# EAGLE design V2_aktuell_StdTeile_panel (EAGLE 6.5.0)

## Sheet 1 of 4
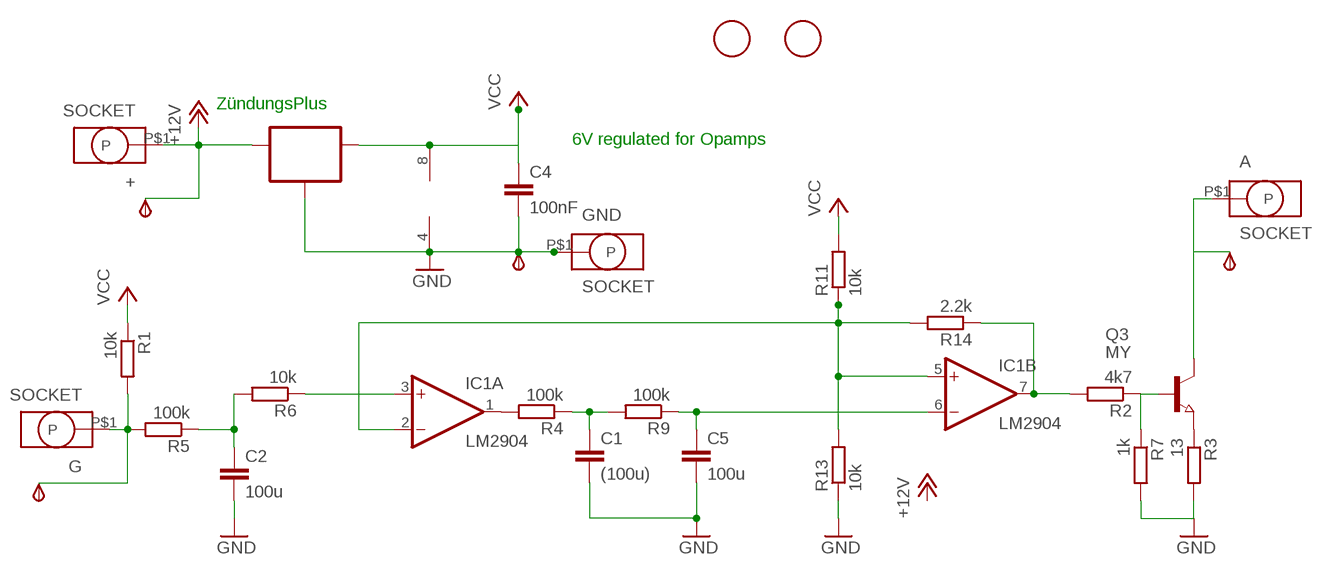
[diagram p0: schematic, sheet 1]

### Parts
+  SOCKET  [ID2.5MM]
A  SOCKET  [ID2.5MM]
C1  (100u)  C-EUC1206K  [C1206K]
C2  100u  C-EUC1206K  [C1206K]
C4  100nF  C-EUC0805  [C0805]
C5  100u  C-EUC1206K  [C1206K]
G  SOCKET  [ID2.5MM]
GND  SOCKET  [ID2.5MM]
GND_  TPSB2.0  [B2.0]
IC1  LM2904  LM358D  [SO08]
IC2  70L06  78LXXSOT89_ROUND  [SOT89_ROUND]
IN  TPSB2.0  [B2.0]
OUT  TPSB2.0  [B2.0]
Q3  MY  NPN-TRANSISTOR_SOT89  [SOT89]
R1  10k  R-EU_R0805  [R0805]
R2  4k7  R-EU_R0805  [R0805]
R3  13  R-EU_R1206  [R1206]
R4  100k  R-EU_R0805  [R0805]
R5  100k  R-EU_R0805  [R0805]
R6  10k  R-EU_R0805  [R0805]
R7  1k  R-EU_R0805  [R0805]
R9  100k  R-EU_R0805  [R0805]
R11  10k  R-EU_R0805  [R0805]
R13  10k  R-EU_R0805  [R0805]
R14  2.2k  R-EU_R0805  [R0805]
U$1  FIDUCIALFIDUCIAL_1MM_WITH_SOLDERMASK  [FIDUCIAL_1MM_WITH_SOLDERMASK]
U$2  FIDUCIALFIDUCIAL_1MM_WITH_SOLDERMASK  [FIDUCIAL_1MM_WITH_SOLDERMASK]
V+  TPSB2.0  [B2.0]

### Nets
+12V: +.P$1(P) IC2.3(IN) V+.TP(PP) ; also sheet 2,3,4
GND: C1.2 C2.2 C4.2 C5.2 GND.P$1(P) GND_.TP(PP) IC1.4(P:V-) IC2.2(GND) IC2.2@1(GND) R3.2 R7.2 R13.1 ; also sheet 2,3,4
N$1: C2.1 R5.1 R6.2
N$2: Q3.1(B) R2.1 R7.1
N$3: C1.1 R4.1 R9.2
N$4: C5.1 IC1.6(B:-IN) R9.1
N$5: IC1.2(A:-IN) IC1.5(B:+IN) R11.1 R13.2 R14.2
N$6: G.P$1(P) IN.TP(PP) R1.2 R5.2
N$7: Q3.3(E) R3.1
N$9: IC1.3(A:+IN) R6.1
N$10: IC1.7(B:OUT) R2.2 R14.1
N$11: A.P$1(P) OUT.TP(PP) Q3.2(C)
N$580: IC1.1(A:OUT) R4.2
VCC: C4.1 IC1.8(P:V+) IC2.1(OUT) R1.1 R11.2 ; also sheet 2,3,4

### Notes on the sheet
- ZündungsPlus
- 6V regulated for Opamps

## Sheet 2 of 4
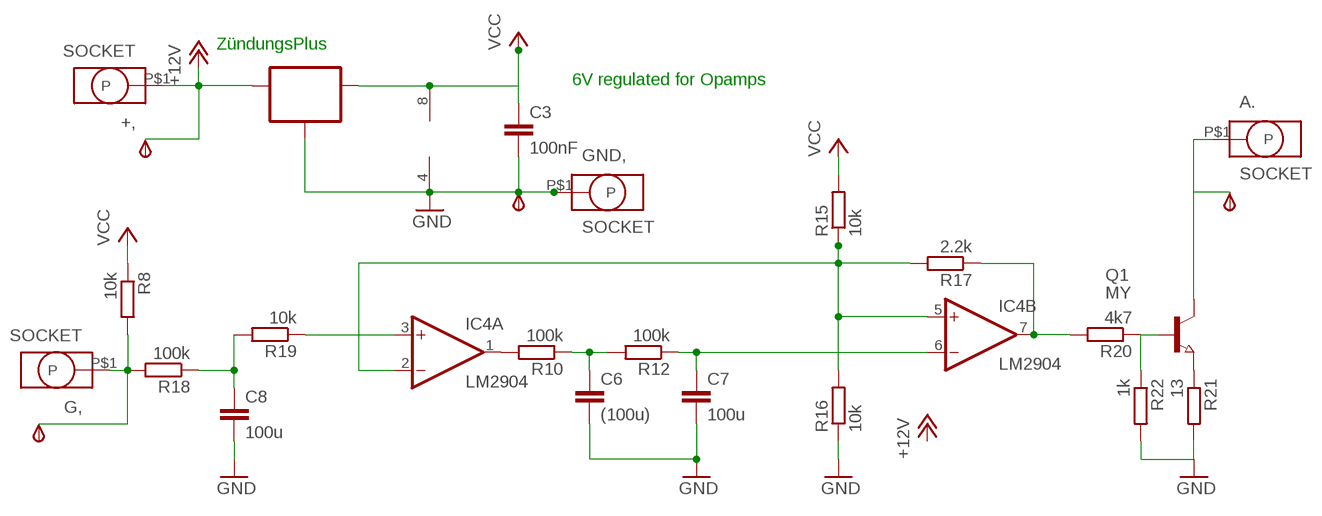
[diagram p1: schematic, sheet 2]

### Parts
+,  SOCKET  [ID2.5MM]
A.  SOCKET  [ID2.5MM]
C3  100nF  C-EUC0805  [C0805]
C6  (100u)  C-EUC1206K  [C1206K]
C7  100u  C-EUC1206K  [C1206K]
C8  100u  C-EUC1206K  [C1206K]
G,  SOCKET  [ID2.5MM]
GND,  SOCKET  [ID2.5MM]
GND_1  TPSB2.0  [B2.0]
IC3  70L06  78LXXSOT89_ROUND  [SOT89_ROUND]
IC4  LM2904  LM358D  [SO08]
IN,  TPSB2.0  [B2.0]
OUT.  TPSB2.0  [B2.0]
Q1  MY  NPN-TRANSISTOR_SOT89  [SOT89]
R8  10k  R-EU_R0805  [R0805]
R10  100k  R-EU_R0805  [R0805]
R12  100k  R-EU_R0805  [R0805]
R15  10k  R-EU_R0805  [R0805]
R16  10k  R-EU_R0805  [R0805]
R17  2.2k  R-EU_R0805  [R0805]
R18  100k  R-EU_R0805  [R0805]
R19  10k  R-EU_R0805  [R0805]
R20  4k7  R-EU_R0805  [R0805]
R21  13  R-EU_R1206  [R1206]
R22  1k  R-EU_R0805  [R0805]
V+,  TPSB2.0  [B2.0]

### Nets
+12V: +,.P$1(P) IC3.3(IN) V+,.TP(PP) ; also sheet 1,3,4
GND: C3.2 C6.2 C7.2 C8.2 GND,.P$1(P) GND_1.TP(PP) IC3.2(GND) IC3.2@1(GND) IC4.4(P:V-) R16.1 R21.2 R22.2 ; also sheet 1,3,4
N$20: IC4.1(A:OUT) R10.2
N$21: C6.1 R10.1 R12.2
N$22: C7.1 IC4.6(B:-IN) R12.1
N$23: IC4.2(A:-IN) IC4.5(B:+IN) R15.1 R16.2 R17.2
N$24: IC4.7(B:OUT) R17.1 R20.2
N$25: C8.1 R18.1 R19.2
N$26: G,.P$1(P) IN,.TP(PP) R8.2 R18.2
N$27: IC4.3(A:+IN) R19.1
N$28: Q1.1(B) R20.1 R22.1
N$29: A..P$1(P) OUT..TP(PP) Q1.2(C)
N$30: Q1.3(E) R21.1
VCC: C3.1 IC3.1(OUT) IC4.8(P:V+) R8.1 R15.2 ; also sheet 1,3,4

### Notes on the sheet
- ZündungsPlus
- 6V regulated for Opamps

## Sheet 3 of 4
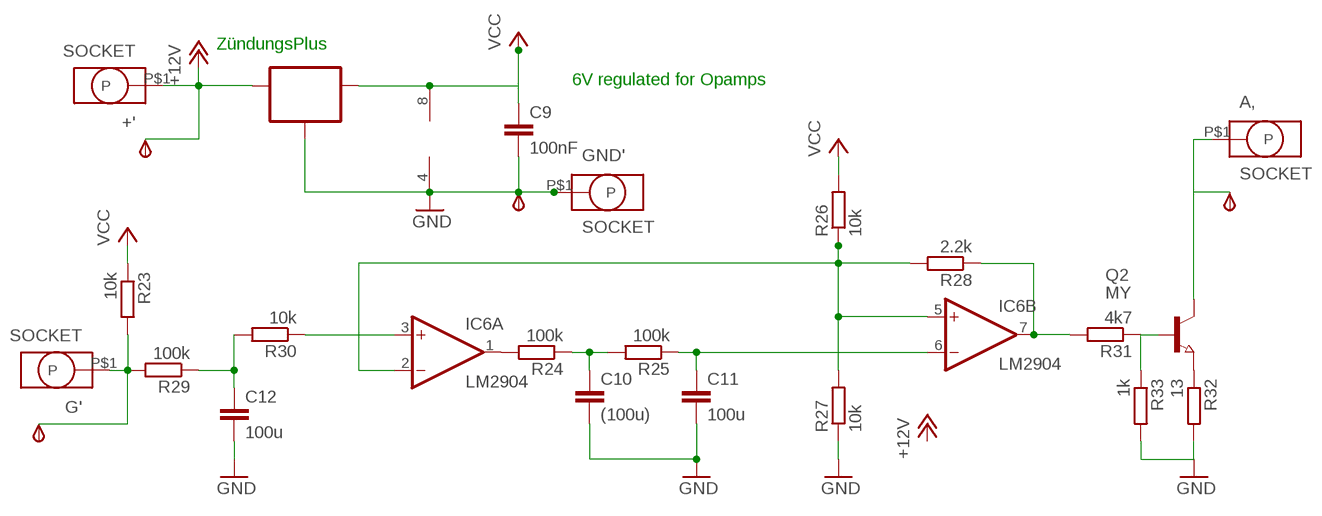
[diagram p2: schematic, sheet 3]

### Parts
+'  SOCKET  [ID2.5MM]
A,  SOCKET  [ID2.5MM]
C9  100nF  C-EUC0805  [C0805]
C10  (100u)  C-EUC1206K  [C1206K]
C11  100u  C-EUC1206K  [C1206K]
C12  100u  C-EUC1206K  [C1206K]
G'  SOCKET  [ID2.5MM]
GND'  SOCKET  [ID2.5MM]
GND_2  TPSB2.0  [B2.0]
IC5  70L06  78LXXSOT89_ROUND  [SOT89_ROUND]
IC6  LM2904  LM358D  [SO08]
IN.  TPSB2.0  [B2.0]
OUT'  TPSB2.0  [B2.0]
Q2  MY  NPN-TRANSISTOR_SOT89  [SOT89]
R23  10k  R-EU_R0805  [R0805]
R24  100k  R-EU_R0805  [R0805]
R25  100k  R-EU_R0805  [R0805]
R26  10k  R-EU_R0805  [R0805]
R27  10k  R-EU_R0805  [R0805]
R28  2.2k  R-EU_R0805  [R0805]
R29  100k  R-EU_R0805  [R0805]
R30  10k  R-EU_R0805  [R0805]
R31  4k7  R-EU_R0805  [R0805]
R32  13  R-EU_R1206  [R1206]
R33  1k  R-EU_R0805  [R0805]
V+.  TPSB2.0  [B2.0]

### Nets
+12V: +'.P$1(P) IC5.3(IN) V+..TP(PP) ; also sheet 1,2,4
GND: C9.2 C10.2 C11.2 C12.2 GND'.P$1(P) GND_2.TP(PP) IC5.2(GND) IC5.2@1(GND) IC6.4(P:V-) R27.1 R32.2 R33.2 ; also sheet 1,2,4
N$40: IC6.1(A:OUT) R24.2
N$41: C10.1 R24.1 R25.2
N$42: C11.1 IC6.6(B:-IN) R25.1
N$43: IC6.2(A:-IN) IC6.5(B:+IN) R26.1 R27.2 R28.2
N$44: IC6.7(B:OUT) R28.1 R31.2
N$45: C12.1 R29.1 R30.2
N$46: G'.P$1(P) IN..TP(PP) R23.2 R29.2
N$47: IC6.3(A:+IN) R30.1
N$48: Q2.1(B) R31.1 R33.1
N$49: A,.P$1(P) OUT'.TP(PP) Q2.2(C)
N$50: Q2.3(E) R32.1
VCC: C9.1 IC5.1(OUT) IC6.8(P:V+) R23.1 R26.2 ; also sheet 1,2,4

### Notes on the sheet
- ZündungsPlus
- 6V regulated for Opamps

## Sheet 4 of 4
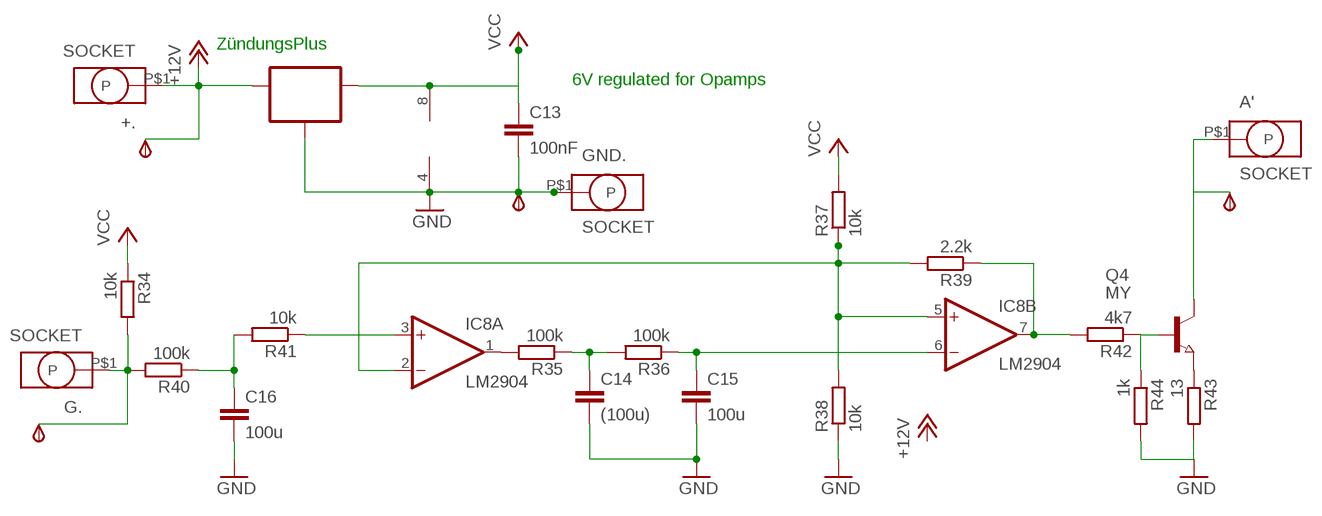
[diagram p3: schematic, sheet 4]

### Parts
+.  SOCKET  [ID2.5MM]
A'  SOCKET  [ID2.5MM]
C13  100nF  C-EUC0805  [C0805]
C14  (100u)  C-EUC1206K  [C1206K]
C15  100u  C-EUC1206K  [C1206K]
C16  100u  C-EUC1206K  [C1206K]
G.  SOCKET  [ID2.5MM]
GND.  SOCKET  [ID2.5MM]
GND_3  TPSB2.0  [B2.0]
IC7  70L06  78LXXSOT89_ROUND  [SOT89_ROUND]
IC8  LM2904  LM358D  [SO08]
IN'  TPSB2.0  [B2.0]
OUT,  TPSB2.0  [B2.0]
Q4  MY  NPN-TRANSISTOR_SOT89  [SOT89]
R34  10k  R-EU_R0805  [R0805]
R35  100k  R-EU_R0805  [R0805]
R36  100k  R-EU_R0805  [R0805]
R37  10k  R-EU_R0805  [R0805]
R38  10k  R-EU_R0805  [R0805]
R39  2.2k  R-EU_R0805  [R0805]
R40  100k  R-EU_R0805  [R0805]
R41  10k  R-EU_R0805  [R0805]
R42  4k7  R-EU_R0805  [R0805]
R43  13  R-EU_R1206  [R1206]
R44  1k  R-EU_R0805  [R0805]
V+'  TPSB2.0  [B2.0]

### Nets
+12V: +..P$1(P) IC7.3(IN) V+'.TP(PP) ; also sheet 1,2,3
GND: C13.2 C14.2 C15.2 C16.2 GND..P$1(P) GND_3.TP(PP) IC7.2(GND) IC7.2@1(GND) IC8.4(P:V-) R38.1 R43.2 R44.2 ; also sheet 1,2,3
N$51: IC8.1(A:OUT) R35.2
N$52: C14.1 R35.1 R36.2
N$53: C15.1 IC8.6(B:-IN) R36.1
N$54: IC8.2(A:-IN) IC8.5(B:+IN) R37.1 R38.2 R39.2
N$55: IC8.7(B:OUT) R39.1 R42.2
N$56: C16.1 R40.1 R41.2
N$57: G..P$1(P) IN'.TP(PP) R34.2 R40.2
N$58: IC8.3(A:+IN) R41.1
N$59: Q4.1(B) R42.1 R44.1
N$60: A'.P$1(P) OUT,.TP(PP) Q4.2(C)
N$61: Q4.3(E) R43.1
VCC: C13.1 IC7.1(OUT) IC8.8(P:V+) R34.1 R37.2 ; also sheet 1,2,3

### Notes on the sheet
- ZündungsPlus
- 6V regulated for Opamps

## Library data of the parts
+ +' +, +. A A' A, A. G G' G, G. GND GND' GND, GND. = Brotbox_Socket_Header:SOCKET
C1-C16 = rcl:C-EU: CAPACITOR, European symbol
GND_ GND_1-GND_3 IN IN' IN, IN. OUT OUT' OUT, OUT. V+ V+' V+, V+. = testpin_BMW:TPS: TEST PIN
IC1 IC4 IC6 IC8 = linear_BMW:LM358: OP AMP also LM158; LM258; LM2904 Source: http://cache.national.com/ds/LM/LM158.pdf
IC2 IC3 IC5 IC7 = 78LXX:78LXX
Q1-Q4 = Transistor_SOT89:NPN-TRANSISTOR_: NPN TRANSISTOR
R1-R44 = rcl:R-EU_: RESISTOR, European symbol
U$1 U$2 = Fiducial:FIDUCIAL: For use by pick and place machines to calibrate the vision/machine, 1mm By microbuilder.eu

## Board
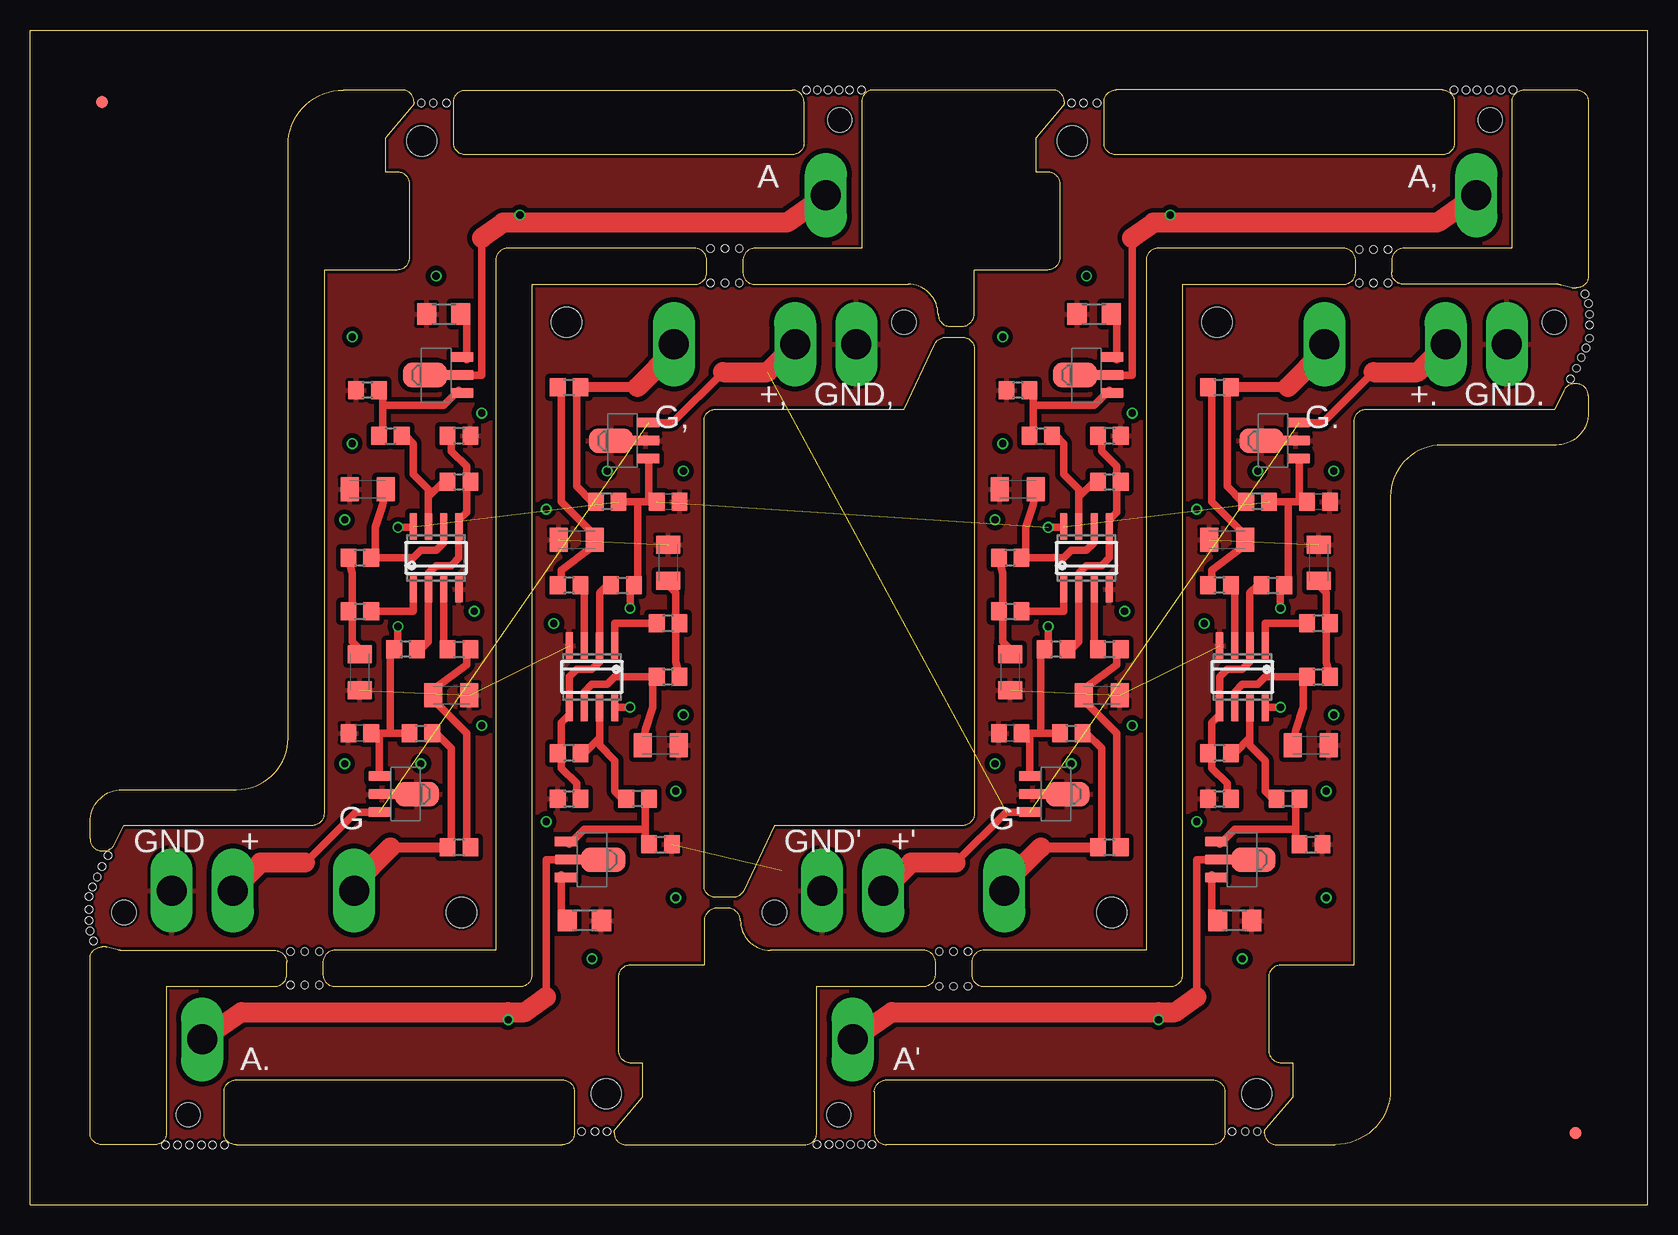
[diagram p4: board, top side]
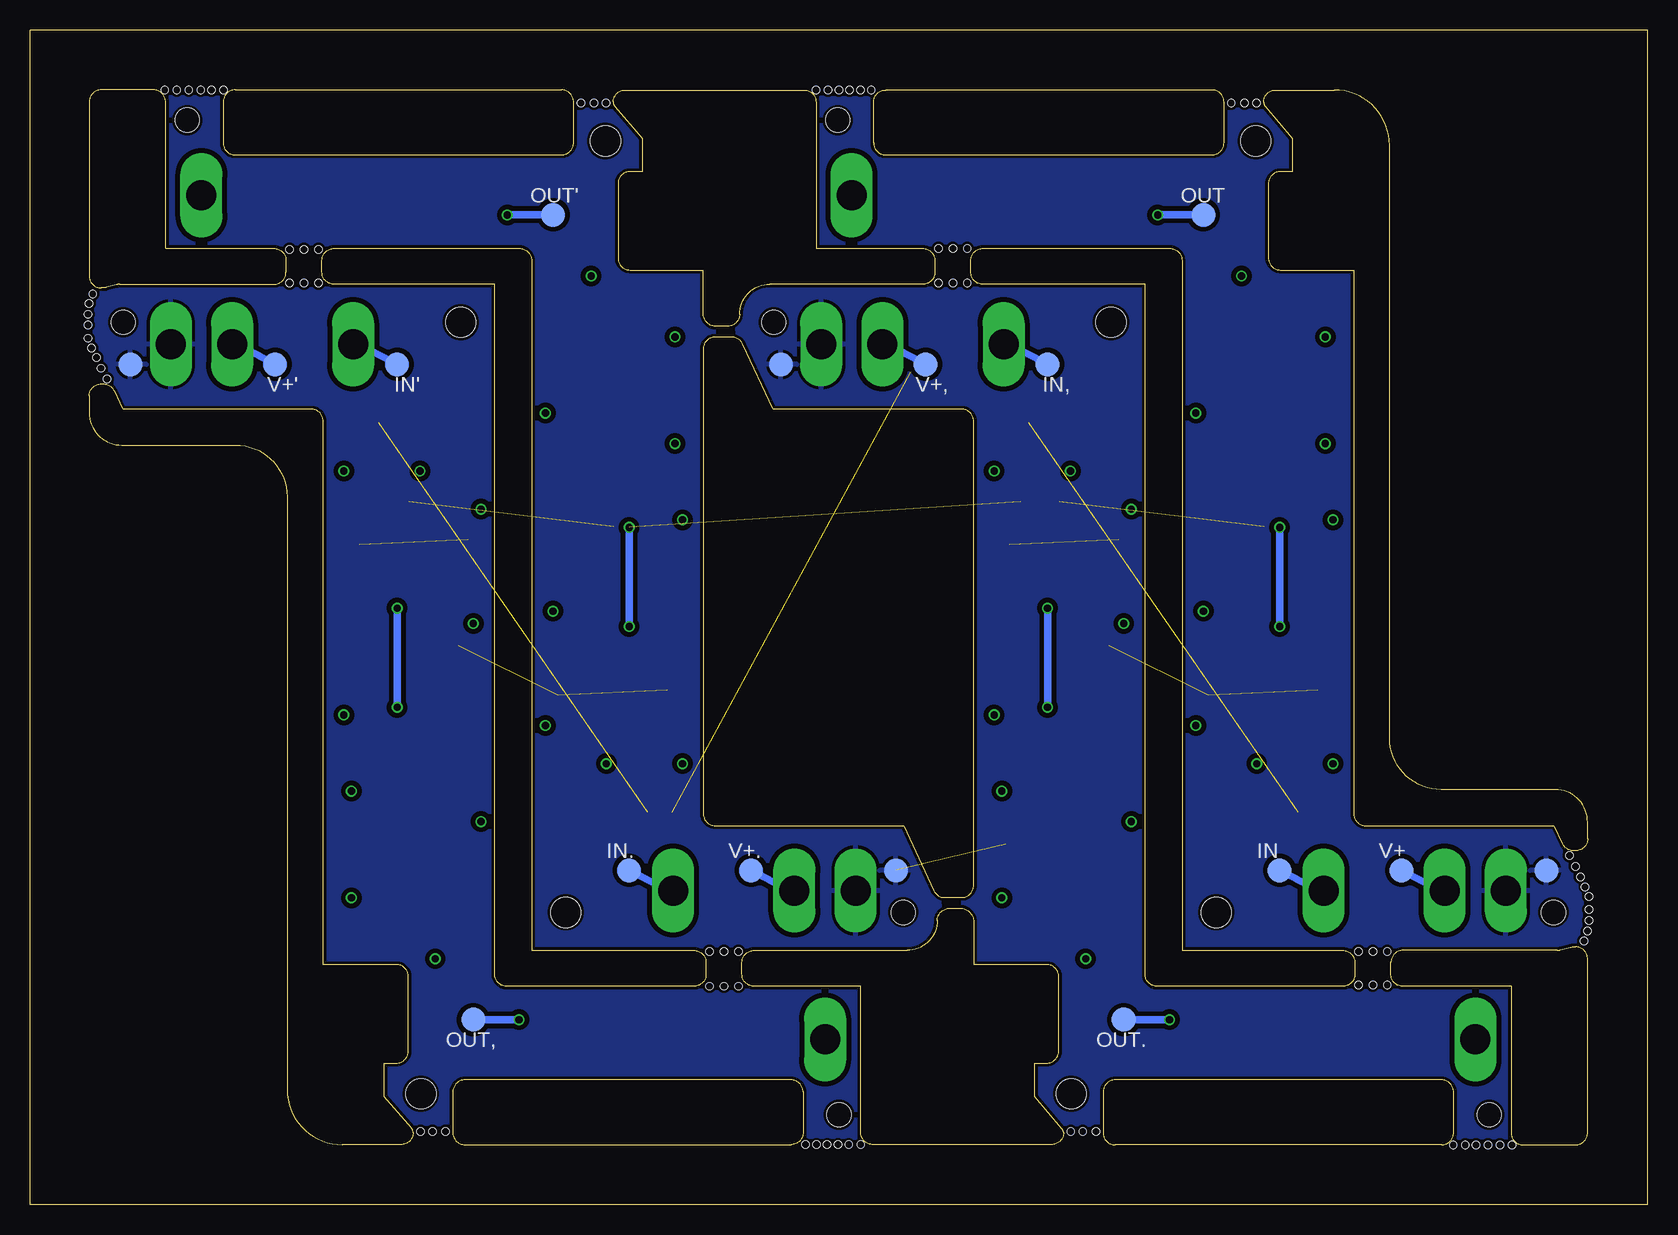
[diagram p5: board, bottom side, seen from below]

Size 134.8 x 97.9 mm. Coordinates in mm from the lower left corner, seen from the top.
Outline: 45.37,6.21 45.37,9.41 arc90 44.37,10.41 17.17,10.41 arc90 16.17,9.41 16.17,6 arc90 17.17,5 44.37,5 arc90 45.37,6 45.37,9.4
Outline: 59.2,23.7 arc90 61.7,21.2
Outline: 70.37,9.41 arc-90 71.37,10.41
Outline: 98.57,10.41 arc-90 99.57,9.41
Outline: 99.57,9.41 99.57,6.01 arc-90 98.57,5.01 71.37,5.01 arc-90 70.37,6.01 70.37,9.41
Outline: 104.27,11.81 arc-90 103.27,12.81
Outline: 103.27,19.01 arc-90 104.27,20.01
Outline: 110.37,65.31 arc-90 111.37,66.31
Outline: 95.07,18.21 arc90 96.07,19.21
Outline: 70.37,9.41 arc-90 71.37,10.41
Outline: 71.37,10.41 98.57,10.41
Outline: 98.57,10.41 arc-90 99.57,9.41
Outline: 104.27,11.81 105.27,11.81 105.27,9.01 103,6.36 arc41 102.87,6.01 arc90 103.87,5.01 108.77,5.01 arc90 113.37,9.61 113.37,59.01 arc-90 117.67,63.31 127.17,63.31 arc90 129.87,66.01 129.87,67.41 arc90 128.87,68.41 128.7,68.41 arc65 127.8,67.84 127.07,66.31 111.37,66.31
Outline: 104.27,11.81 arc-90 103.27,12.81
Outline: 103.27,12.81 103.27,19.01
Outline: 103.27,19.01 arc-90 104.27,20.01
Outline: 104.27,20.01 110.37,20.01 110.37,65.31
Outline: 110.37,65.31 arc-90 111.37,66.31
Outline: 61.7,21.2 74.47,21.2 arc-90 75.47,20.2 75.47,19.21 arc-90 74.47,18.21 65.57,18.21 65.57,6.01 arc-90 64.57,5.01 49.67,5.01 arc-90 48.67,6 arc-41 48.8,6.35 51.07,9.01 51.07,11.81 50.07,11.81 arc-90 49.07,12.81 49.07,19.01 arc-90 50.07,20.01 56.17,20.01 56.17,23.71 arc-90 57.37,24.71 58.17,24.71 arc-90 59.2,23.68 59.2,23.7
Outline: 95.07,18.21 79.47,18.21 arc-90 78.47,19.21 78.47,20.2 arc-90 79.47,21.2 93,21.2 93,78.7 arc-90 94,79.7 109.47,79.7 arc-90 110.47,78.7 110.47,77.71 arc-90 109.47,76.71 96.07,76.71 96.07,19.21
Outline: 95.07,18.21 arc90 96.07,19.21
Outline: 89.5,91.7 89.5,88.5 arc90 90.5,87.5 117.7,87.5 arc90 118.7,88.5 118.7,91.91 arc90 117.7,92.91 90.5,92.91 arc90 89.5,91.91 89.5,88.51
Outline: 59.2,23.7 arc90 61.7,21.2
Outline: 0,97.9 134.8,97.9 134.8,0 0,0 0,97.9
Outline: 64.5,88.5 64.5,91.9 arc90 63.5,92.9 36.3,92.9 arc90 35.3,91.9 35.3,88.5 arc90 36.3,87.5 63.5,87.5 arc90 64.5,88.5
Outline: 32,91.9 arc-41 31.87,91.55 29.6,88.9 29.6,86.1 30.6,86.1 arc-90 31.6,85.1 31.6,78.9 arc-90 30.6,77.9 24.5,77.9 24.5,32.6 arc-90 23.5,31.6 7.8,31.6 7.07,30.07 arc-65 6.17,29.5 6,29.5 arc-90 5,30.5 5,31.9 arc-90 7.7,34.6 17.2,34.6 arc90 21.5,38.9 21.5,88.3 arc-90 26.1,92.9 31,92.9 arc-90 32,91.9
Outline: 70.3,92.9 arc90 69.3,91.9 69.3,79.7 60.4,79.7 arc90 59.4,78.7 59.4,77.71 arc90 60.4,76.71 73.17,76.71 arc-90 75.67,74.21 75.67,74.23 arc90 76.7,73.2 77.5,73.2 arc90 78.7,74.2 78.7,77.9 84.8,77.9 arc90 85.8,78.9 85.8,85.1 arc90 84.8,86.1 83.8,86.1 83.8,88.9 86.07,91.56 arc41 86.2,91.91 arc90 85.2,92.9 70.3,92.9
Outline: 56.4,77.71 56.4,78.7 arc90 55.4,79.7 39.8,79.7 arc90 38.8,78.7 38.8,21.2 25.4,21.2 arc90 24.4,20.2 24.4,19.21 arc90 25.4,18.21 40.87,18.21 arc90 41.87,19.21 41.87,76.71 55.4,76.71 arc90 56.4,77.71
Outline: 7.53,21.2 20.4,21.2 arc-90 21.4,20.2 21.4,19.21 arc-90 20.4,18.21 11.37,18.21 11.37,6 arc-90 10.37,5 6,5 arc-90 5,6 5,20.5 arc-90 6,21.5 6.17,21.5 arc-15 6.43,21.47 7.27,21.23 arc15 7.53,21.2
Outline: 56.17,65.31 arc-90 57.17,66.31 72.87,66.31 75.4,71.72 arc-65 76.31,72.3 77.7,72.3 arc-90 78.7,71.3 78.7,32.6 arc-90 77.7,31.6 62,31.6 59.47,26.19 arc-65 58.56,25.61 57.17,25.61 arc-90 56.17,26.61 56.17,65.31
Outline: 127.34,76.71 114.47,76.71 arc-90 113.47,77.71 113.47,78.7 arc-90 114.47,79.7 123.5,79.7 123.5,91.91 arc-90 124.5,92.91 128.87,92.91 arc-90 129.87,91.91 129.87,77.41 arc-90 128.87,76.41 128.7,76.41 arc-15 128.44,76.45 127.6,76.68 arc15 127.34,76.71
Copper layers (1*16): Top 0.035mm / dielectric 1.5mm / Bottom 0.035mm
Design rules "SeeedStudio_2layer_DRU_no_angle_20140221 *": minimum track width 24mil, minimum drill 12mil, track to track 0.4mm, track to pad 0.4mm, pad to pad 0.4mm, via to via 0.4mm, smd to smd 0mil, copper to edge 10mil, drill to drill 10mil, minimum pad ring 10mil, minimum via ring 6mil, stop-mask expansion 2mil, vias tented up to drill 100mil, thermal gap 10mil
Holes 2.5 mm at 35.96,24.37 32.65,88.65 44.71,73.54 48.02,9.26 90.16,24.37 86.85,88.65 98.91,73.54 102.22,9.26 98.91,73.54 102.22,9.26
Holes 2 mm at 67.48,90.39 7.84,24.37 13.19,7.52 72.83,73.54 121.68,90.39 62.04,24.37 67.39,7.52 127.03,73.54 67.39,7.52 127.03,73.54
Holes 0.6 mm at 69.3,92.9 68.3,92.9 67.4,92.9 66.5,92.9 65.6,92.9 64.7,92.9 34.7,91.8 33.6,91.8 32.6,91.8 6.5,29.1 6,28.2 5.6,27.3 5.2,26.5 4.9,25.7 4.9,24.6 4.9,23.7 5,22.8 5.3,22 11.3,5 12.3,5 13.3,5 14.3,5 15.2,5 16.2,5 45.97,6.1 47.07,6.1 48.07,6.1 56.7,79.7 57.9,79.7 59.1,79.7 57.9,76.8 56.7,76.8 59.1,76.8 21.7,21.1 22.9,21.1 24.1,21.1 21.7,18.3 22.9,18.3 24.1,18.3 65.57,5.01 66.57,5.01 67.47,5.01 68.37,5.01 69.27,5.01 70.17,5.01 100.17,6.11 101.27,6.11 102.27,6.11 128.37,68.81 128.87,69.71 129.27,70.61 129.67,71.41 129.97,72.21 129.97,73.31 129.97,74.21 129.87,75.11 129.57,75.91 123.57,92.91 122.57,92.91 121.57,92.91 120.57,92.91 119.67,92.91 118.67,92.91 88.9,91.81 87.8,91.81 86.8,91.81 78.17,18.21 76.97,18.21 75.77,18.21 76.97,21.11 78.17,21.11 75.77,21.11 113.17,76.81 111.97,76.81 110.77,76.81 113.17,79.61 111.97,79.61 110.77,79.61
Milling: 205 lines

### Footprints (pad centres in the part's own frame; a part is rotated, then mirrored left to right if it is on the bottom)
ID2.5MM = drill 2.5 long: P$1 0,0
C1206K = smd 1.5 x 2: 1 -1.5,0; 2 1.5,0
C0805 = smd 1.3 x 1.5: 1 -0.95,0; 2 0.95,0
B2.0 = smd 2 x 2: TP 0,0
SO08 = smd 0.6 x 2.2: 1 -1.905,-2.6; 2 -0.635,-2.6; 3 0.635,-2.6; 4 1.905,-2.6; 5 1.905,2.6; 6 0.635,2.6; 7 -0.635,2.6; 8 -1.905,2.6
SOT89_ROUND = smd 0.8 x 1.8: 1 -1.499,-2.181; 3 1.499,-2.181 | smd 0.8 x 2.3: 2 0,-1.927 | smd 2.032 x 3.65: 2@1 0,0.94
SOT89 = smd 0.8 x 1.8: 1 -1.499,-2.181; 3 1.499,-2.181 | smd 0.8 x 2.3: 2 0,-1.927 | smd 2.032 x 3.65: 2@1 0,0.94
R0805 = smd 1.3 x 1.5: 1 -0.95,0; 2 0.95,0
R1206 = smd 1.6 x 1.803: 1 -1.422,0; 2 1.422,0
FIDUCIAL_1MM_WITH_SOLDERMASK = smd 1 x 1: 1 0,0

### Placement (x,y rotation side)
+  16.91,26.19 90 top
+'  71.11,26.19 90 top
+,  63.76,71.72 270 top
+.  117.96,71.72 270 top
A  66.33,84.12 90 top
A'  68.54,13.79 270 top
A,  120.53,84.12 90 top
A.  14.34,13.79 270 top
C1  27.49,44.38 270 top
C2  35.11,42.48 0 top
C3  53.18,58.6 0 top
C4  27.49,39.3 180 top
C5  28.12,59.62 180 top
C6  53.18,53.52 90 top
C7  52.55,38.28 0 top
C8  45.56,55.43 180 top
C9  81.69,39.3 180 top
C10  81.69,44.38 270 top
C11  82.33,59.62 180 top
C12  89.31,42.48 0 top
C13  107.38,58.6 0 top
C14  107.38,53.52 90 top
C15  106.75,38.28 0 top
C16  99.76,55.43 180 top
G  27.01,26.19 90 top
G'  81.21,26.19 90 top
G,  53.66,71.72 270 top
G.  107.86,71.72 270 top
GND  11.81,26.19 90 top
GND'  66.01,26.19 90 top
GND,  68.86,71.72 270 top
GND.  123.06,71.72 270 top
GND_  8.44,27.88 0 bottom
GND_1  72.23,70.04 180 bottom
GND_2  62.64,27.88 0 bottom
GND_3  126.43,70.04 180 bottom
IC1  33.84,53.91 0 top
IC2  31.3,34.23 270 top
IC3  49.37,63.68 90 top
IC4  46.83,44 180 top
IC5  85.5,34.23 270 top
IC6  88.04,53.91 0 top
IC7  103.57,63.68 90 top
IC8  101.03,44 180 top
IN  30.66,27.88 0 bottom
IN'  104.21,70.04 180 bottom
IN,  50,70.04 180 bottom
IN.  84.87,27.88 0 bottom
OUT  37.02,82.48 0 bottom
OUT'  91.22,82.48 0 bottom
OUT,  97.86,15.43 180 bottom
OUT.  43.66,15.43 180 bottom
Q1  46.83,28.76 270 top
Q2  88.04,69.15 90 top
Q3  33.84,69.15 90 top
Q4  101.03,28.76 270 top
R1  32.57,39.3 0 top
R2  30.03,64.07 0 top
R3  34.48,74.23 180 top
R4  27.49,49.46 0 top
R5  35.74,29.78 180 top
R6  35.74,46.29 0 top
R7  28.12,67.88 180 top
R8  48.1,58.6 180 top
R9  27.49,53.91 180 top
R10  53.18,48.45 180 top
R11  31.3,46.29 180 top
R12  53.18,44 0 top
R13  35.74,64.07 180 top
R14  35.74,60.26 0 top
R15  49.37,51.62 0 top
R16  44.92,33.84 0 top
R17  44.92,37.65 180 top
R18  44.92,68.13 0 top
R19  44.92,51.62 180 top
R20  50.64,33.84 180 top
R21  46.2,23.68 0 top
R22  52.55,30.03 0 top
R23  86.77,39.3 0 top
R24  81.69,49.46 0 top
R25  81.69,53.91 180 top
R26  85.5,46.29 180 top
R27  89.95,64.07 180 top
R28  89.95,60.26 0 top
R29  89.95,29.78 180 top
R30  89.95,46.29 0 top
R31  84.23,64.07 0 top
R32  88.68,74.23 180 top
R33  82.33,67.88 180 top
R34  102.3,58.6 180 top
R35  107.38,48.45 180 top
R36  107.38,44 0 top
R37  103.57,51.62 0 top
R38  99.12,33.84 0 top
R39  99.12,37.65 180 top
R40  99.12,68.13 0 top
R41  99.12,51.62 180 top
R42  104.84,33.84 180 top
R43  100.4,23.68 0 top
R44  106.75,30.03 0 top
U$1  6,91.9 0 top
U$2  128.8,6 0 top
V+  20.5,27.88 0 bottom
V+'  114.37,70.04 180 bottom
V+,  60.16,70.04 180 bottom
V+.  74.71,27.88 0 bottom

### Tracks (layer width: path | path; a pad name or v marks a point on that pad's centre or on a via)
+12V  (3 unrouted)
  Top 0.61: IC2.3 27.13,32.73 22.92,28.51 | IC3.3 53.54,65.18 57.75,69.4 | IC5.3 81.33,32.73 77.12,28.51 | IC7.3 107.74,65.18 111.95,69.4
  Top 1.676: 22.92,28.51 19.23,28.51 +.P$1 | 57.75,69.4 61.44,69.4 +,.P$1 | 77.12,28.51 73.43,28.51 +'.P$1 | 111.95,69.4 115.64,69.4 +..P$1
  Bottom 0.61: V+.TP 16.91,25.97 +.P$1 | V+,.TP 63.76,71.94 +,.P$1 | V+..TP 71.11,25.97 +'.P$1 | V+'.TP 117.96,71.94 +..P$1
GND  (7 unrouted)
  pour Bottom: 4.63,20.89 38.92,20.89 38.92,79.56 69.4,79.56 69.4,93.92 30.66,93.92 23.68,78.04 23.68,34.86 21.77,32.32 5.26,32.32
  pour Top: 4.63,20.89 38.92,20.89 38.92,79.82 69.4,79.82 69.4,93.92 30.66,93.92 24.31,78.04 23.68,34.86 21.14,32.32 4.63,32.32
  pour Bottom: 76.04,77.02 41.75,77.02 41.75,18.35 11.27,18.35 11.27,4 50,4 56.99,19.87 56.99,63.05 58.89,65.59 75.41,65.59
  pour Top: 76.04,77.02 41.75,77.02 41.75,18.09 11.27,18.09 11.27,4 50,4 56.35,19.87 56.99,63.05 59.53,65.59 76.04,65.59
  pour Bottom: 58.83,20.89 93.12,20.89 93.12,79.56 123.6,79.56 123.6,93.92 84.87,93.92 77.88,78.04 77.88,34.86 75.98,32.32 59.46,32.32
  pour Top: 58.83,20.89 93.12,20.89 93.12,79.82 123.6,79.82 123.6,93.92 84.87,93.92 78.52,78.04 77.88,34.86 75.34,32.32 58.83,32.32
  pour Bottom: 130.24,77.02 95.95,77.02 95.95,18.35 65.47,18.35 65.47,4 104.21,4 111.19,19.87 111.19,63.05 113.09,65.59 129.6,65.59
  pour Top: 130.24,77.02 95.95,77.02 95.95,18.09 65.47,18.09 65.47,4 104.21,4 110.56,19.87 111.19,63.05 113.73,65.59 130.24,65.59
N$1
  Top 0.61: 33.84,42.48 33.84,41.84 36.38,39.3 36.38,29.78 R5.1 | 33.84,42.48 33.84,43.12 36.38,45.02 36.38,46.29 R6.2 | 33.84,42.48 C2.1
N$2
  Top 0.61: 29.39,66.61 29.39,64.07 R2.1 | 29.39,66.61 29.39,67.88 R7.1 | 29.39,66.61 34.48,66.61 35.74,67.88 Q3.1
N$3
  Top 0.61: 26.85,49.46 26.85,52.64 R9.2 | 26.85,49.46 26.85,46.92 27.49,46.29 C1.1 | 26.85,49.46 R4.1
N$4
  Top 0.61: IC1.6 34.48,55.18 33.84,54.55 32.57,54.55 31.93,53.91 R9.1 28.76,54.55 28.76,56.45 29.39,58.35 C5.1
N$5
  Top 0.61: R11.1 32.57,46.29 33.2,46.92 IC1.2 33.2,52.64 33.84,53.27 35.11,53.27 35.74,53.91 IC1.5 35.74,57.09 36.38,57.72 36.38,60.26 | 36.38,60.26 36.38,61.53 35.11,62.8 35.11,64.07 R13.2 | 36.38,60.26 R14.2
N$6
  Top 0.61: R1.2 33.84,39.3 35.11,38.03 35.11,29.78 R5.2
  Top 0.813: 30.03,29.78 R5.2
  Top 1.676: G.P$1 27.01,26.76 30.03,29.78
  Bottom 0.61: IN.TP 27.01,25.97 G.P$1
N$7
  Top 0.61: Q3.3 36.38,70.42 36.38,74.23 R3.1
N$8  (via drill 0.6)
  other vias: 32.57,36.77
N$9
  Top 0.61: IC1.3 34.48,46.29 R6.1
N$10
  Top 0.61: IC1.7 33.2,58.99 | 33.2,58.99 33.2,59.62 31.93,60.89 31.93,63.43 31.3,64.07 R2.2 | 33.2,58.99 34.48,60.26 R14.1
N$11  (via drill 0.6)
  Top 0.61: Q3.2 37.65,69.15 37.65,80.58 | v40.82,82.48 40.82,81.85
  Top 1.676: A.P$1 63.05,81.85 40.82,81.85 39.43,81.85 37.65,80.58
  Bottom 0.61: OUT.TP v40.82,82.48
N$12  (via drill 0.6)
  other vias: 37.02,49.46
N$13  (via drill 0.6)
  other vias: 26.85,63.43
N$14  (via drill 0.6)
  other vias: 26.85,72.33
N$15  (via drill 0.6)
  other vias: 33.84,77.41
N$16  (via drill 0.6)
  other vias: 37.65,65.98
N$17  (via drill 0.6)
  other vias: 37.65,39.94
N$18  (via drill 0.6)
  other vias: 26.22,36.77
N$19  (via drill 0.6)
  other vias: 26.22,57.09
N$20
  Top 0.61: R10.2 48.73,48.45 IC4.1
N$21
  Top 0.61: 53.81,48.45 53.81,45.27 R12.2 | 53.81,48.45 53.81,50.98 53.18,51.62 C6.1 | 53.81,48.45 R10.1
N$22
  Top 0.61: IC4.6 46.2,42.73 46.83,43.37 48.1,43.37 48.73,44 R12.1 51.91,43.37 51.91,41.46 51.27,39.55 C7.1
N$23
  Top 0.61: R15.1 48.1,51.62 47.46,50.98 IC4.2 47.46,45.27 46.83,44.63 45.56,44.63 44.92,44 IC4.5 44.92,40.82 44.29,40.19 44.29,37.65 | 44.29,37.65 44.29,36.38 45.56,35.11 45.56,33.84 R16.2 | 44.29,37.65 R17.2
N$24
  Top 0.61: IC4.7 47.46,38.92 | 47.46,38.92 47.46,38.28 48.73,37.02 48.73,34.48 49.37,33.84 R20.2 | 47.46,38.92 46.2,37.65 R17.1
N$25
  Top 0.61: 46.83,55.43 46.83,56.06 44.29,58.6 44.29,68.13 R18.1 | 46.83,55.43 46.83,54.8 44.29,52.89 44.29,51.62 R19.2 | 46.83,55.43 C8.1
N$26
  Top 0.61: R8.2 46.83,58.6 45.56,59.88 45.56,68.13 R18.2
  Top 0.813: 50.64,68.13 R18.2
  Top 1.676: G,.P$1 53.66,71.15 50.64,68.13
  Bottom 0.61: IN,.TP 53.66,71.94 G,.P$1
N$27
  Top 0.61: IC4.3 46.2,51.62 R19.1
N$28
  Top 0.61: 51.27,31.3 51.27,33.84 R20.1 | 51.27,31.3 51.27,30.03 R22.1 | 51.27,31.3 46.2,31.3 44.92,30.03 Q1.1
N$29  (via drill 0.6)
  Top 0.61: Q1.2 43.02,28.76 43.02,17.33 | v39.84,15.43 39.84,16.06
  Top 1.676: A..P$1 17.62,16.06 39.84,16.06 41.24,16.06 43.02,17.33
  Bottom 0.61: OUT..TP v39.84,15.43
N$30
  Top 0.61: Q1.3 44.29,27.49 44.29,23.68 R21.1
N$31  (via drill 0.6)
  other vias: 48.1,61.14
N$32  (via drill 0.6)
  other vias: 43.66,48.45
N$33  (via drill 0.6)
  other vias: 53.81,34.48
N$34  (via drill 0.6)
  other vias: 53.81,25.59
N$35  (via drill 0.6)
  other vias: 46.83,20.51
N$36  (via drill 0.6)
  other vias: 43.02,31.94
N$37  (via drill 0.6)
  other vias: 43.02,57.97
N$38  (via drill 0.6)
  other vias: 54.45,61.14
N$39  (via drill 0.6)
  other vias: 54.45,40.82
N$40
  Top 0.61: R24.2 86.14,49.46 IC6.1
N$41
  Top 0.61: 81.06,49.46 81.06,52.64 R25.2 | 81.06,49.46 81.06,46.92 81.69,46.29 C10.1 | 81.06,49.46 R24.1
N$42
  Top 0.61: IC6.6 88.68,55.18 88.04,54.55 86.77,54.55 86.14,53.91 R25.1 82.96,54.55 82.96,56.45 83.59,58.35 C11.1
N$43
  Top 0.61: R26.1 86.77,46.29 87.41,46.92 IC6.2 87.41,52.64 88.04,53.27 89.31,53.27 89.95,53.91 IC6.5 89.95,57.09 90.58,57.72 90.58,60.26 | 90.58,60.26 90.58,61.53 89.31,62.8 89.31,64.07 R27.2 | 90.58,60.26 R28.2
N$44
  Top 0.61: IC6.7 87.41,58.99 | 87.41,58.99 87.41,59.62 86.14,60.89 86.14,63.43 85.5,64.07 R31.2 | 87.41,58.99 88.68,60.26 R28.1
N$45
  Top 0.61: 88.04,42.48 88.04,41.84 90.58,39.3 90.58,29.78 R29.1 | 88.04,42.48 88.04,43.12 90.58,45.02 90.58,46.29 R30.2 | 88.04,42.48 C12.1
N$46
  Top 0.61: R23.2 88.04,39.3 89.31,38.03 89.31,29.78 R29.2
  Top 0.813: 84.23,29.78 R29.2
  Top 1.676: G'.P$1 81.21,26.76 84.23,29.78
  Bottom 0.61: IN..TP 81.21,25.97 G'.P$1
N$47
  Top 0.61: IC6.3 88.68,46.29 R30.1
N$48
  Top 0.61: 83.59,66.61 83.59,64.07 R31.1 | 83.59,66.61 83.59,67.88 R33.1 | 83.59,66.61 88.68,66.61 89.95,67.88 Q2.1
N$49  (via drill 0.6)
  Top 0.61: Q2.2 91.85,69.15 91.85,80.58 | v95.03,82.48 95.03,81.85
  Top 1.676: A,.P$1 117.25,81.85 95.03,81.85 93.63,81.85 91.85,80.58
  Bottom 0.61: OUT'.TP v95.03,82.48
N$50
  Top 0.61: Q2.3 90.58,70.42 90.58,74.23 R32.1
N$51
  Top 0.61: R35.2 102.94,48.45 IC8.1
N$52
  Top 0.61: 108.02,48.45 108.02,45.27 R36.2 | 108.02,48.45 108.02,50.98 107.38,51.62 C14.1 | 108.02,48.45 R35.1
N$53
  Top 0.61: IC8.6 100.4,42.73 101.03,43.37 102.3,43.37 102.94,44 R36.1 106.11,43.37 106.11,41.46 105.48,39.55 C15.1
N$54
  Top 0.61: R37.1 102.3,51.62 101.67,50.98 IC8.2 101.67,45.27 101.03,44.63 99.76,44.63 99.12,44 IC8.5 99.12,40.82 98.49,40.19 98.49,37.65 | 98.49,37.65 98.49,36.38 99.76,35.11 99.76,33.84 R38.2 | 98.49,37.65 R39.2
N$55
  Top 0.61: IC8.7 101.67,38.92 | 101.67,38.92 101.67,38.28 102.94,37.02 102.94,34.48 103.57,33.84 R42.2 | 101.67,38.92 100.4,37.65 R39.1
N$56
  Top 0.61: 101.03,55.43 101.03,56.06 98.49,58.6 98.49,68.13 R40.1 | 101.03,55.43 101.03,54.8 98.49,52.89 98.49,51.62 R41.2 | 101.03,55.43 C16.1
N$57
  Top 0.61: R34.2 101.03,58.6 99.76,59.88 99.76,68.13 R40.2
  Top 0.813: 104.84,68.13 R40.2
  Top 1.676: G..P$1 107.86,71.15 104.84,68.13
  Bottom 0.61: IN'.TP 107.86,71.94 G..P$1
N$58
  Top 0.61: IC8.3 100.4,51.62 R41.1
N$59
  Top 0.61: 105.48,31.3 105.48,33.84 R42.1 | 105.48,31.3 105.48,30.03 R44.1 | 105.48,31.3 100.4,31.3 99.12,30.03 Q4.1
N$60  (via drill 0.6)
  Top 0.61: Q4.2 97.22,28.76 97.22,17.33 | v94.05,15.43 94.05,16.06
  Top 1.676: A'.P$1 71.82,16.06 94.05,16.06 95.44,16.06 97.22,17.33
  Bottom 0.61: OUT,.TP v94.05,15.43
N$61
  Top 0.61: Q4.3 98.49,27.49 98.49,23.68 R43.1
N$62  (via drill 0.6)
  other vias: 86.77,36.77
N$63  (via drill 0.6)
  other vias: 91.22,49.46
N$64  (via drill 0.6)
  other vias: 81.06,63.43
N$65  (via drill 0.6)
  other vias: 81.06,72.33
N$66  (via drill 0.6)
  other vias: 88.04,77.41
N$67  (via drill 0.6)
  other vias: 91.85,65.98
N$68  (via drill 0.6)
  other vias: 91.85,39.94
N$69  (via drill 0.6)
  other vias: 80.42,36.77
N$70  (via drill 0.6)
  other vias: 80.42,57.09
N$71  (via drill 0.6)
  other vias: 102.3,61.14
N$72  (via drill 0.6)
  other vias: 97.86,48.45
N$73  (via drill 0.6)
  other vias: 108.02,34.48
N$74  (via drill 0.6)
  other vias: 108.02,25.59
N$75  (via drill 0.6)
  other vias: 101.03,20.51
N$76  (via drill 0.6)
  other vias: 97.22,31.94
N$77  (via drill 0.6)
  other vias: 97.22,57.97
N$78  (via drill 0.6)
  other vias: 108.65,61.14
N$79  (via drill 0.6)
  other vias: 108.65,40.82
N$580
  Top 0.61: R4.2 31.93,49.46 IC1.1
VCC  (via drill 0.6)  (3 unrouted)
  Top 0.61: C4.1 29.12,39.3 | 29.12,39.3 IC2.1 | R1.1 30.03,39.3 | 30.03,39.3 29.12,39.3 | 30.03,39.3 30.03,46.29 R11.2 30.66,46.29 v30.66,48.2 | v30.66,56.45 31.88,56.45 IC1.8 | C3.1 51.55,58.6 | 51.55,58.6 IC3.1 | R8.1 50.64,58.6 | 50.64,58.6 51.55,58.6 | 50.64,58.6 50.64,51.62 R15.2 50,51.62 v50,49.71 | v50,41.46 48.8,41.46 IC4.8 | C9.1 83.32,39.3 | 83.32,39.3 IC5.1 | R23.1 84.23,39.3 | 84.23,39.3 83.32,39.3 | 84.23,39.3 84.23,46.29 R26.2 84.87,46.29 v84.87,48.2 | v84.87,56.45 86.08,56.45 IC6.8 | C13.1 105.75,58.6 | 105.75,58.6 IC7.1 | R34.1 104.84,58.6 | 104.84,58.6 105.75,58.6 | 104.84,58.6 104.84,51.62 R37.2 104.21,51.62 v104.21,49.71 | v104.21,41.46 103,41.46 IC8.8
  Bottom 0.61: v30.66,48.2 v30.66,56.45 | v50,49.71 v50,41.46 | v84.87,48.2 v84.87,56.45 | v104.21,49.71 v104.21,41.46